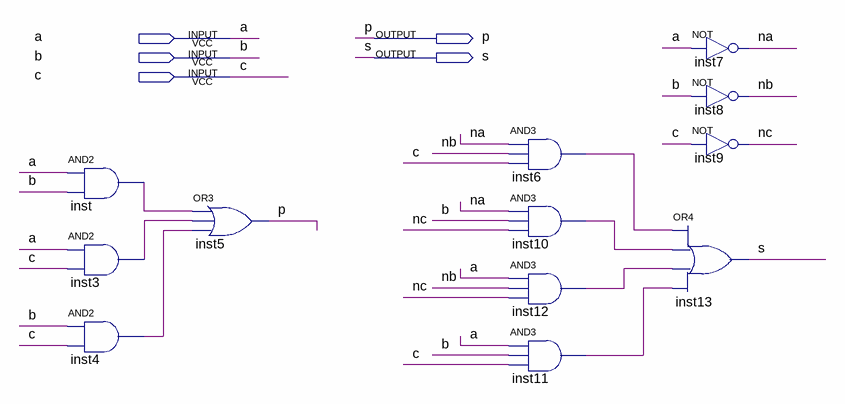
[diagram p0: schematic sheet]
// Quartus schematic s22_sum.bdf as structural Verilog: 12 symbols, 5 pins
module s22_sum (
  input  a,
  input  b,
  input  c,
  output p,
  output s
);

  wire inst3_out, inst4_out, inst6_out, inst10_out, inst11_out, inst12_out, inst_out, na, nb, nc;

  and inst (inst_out, a, b);
  and inst3 (inst3_out, a, c);
  and inst4 (inst4_out, b, c);
  or inst5 (p, inst_out, inst3_out, inst4_out);
  and inst6 (inst6_out, na, nb, c);
  and inst10 (inst10_out, na, b, nc);
  and inst12 (inst12_out, a, nb, nc);
  and inst11 (inst11_out, a, b, c);
  not inst7 (na, a);
  not inst8 (nb, b);
  not inst9 (nc, c);
  or inst13 (s, inst6_out, inst10_out, inst12_out, inst11_out);
endmodule
